# Altium schematic sheet POWER.SchDoc
size A4
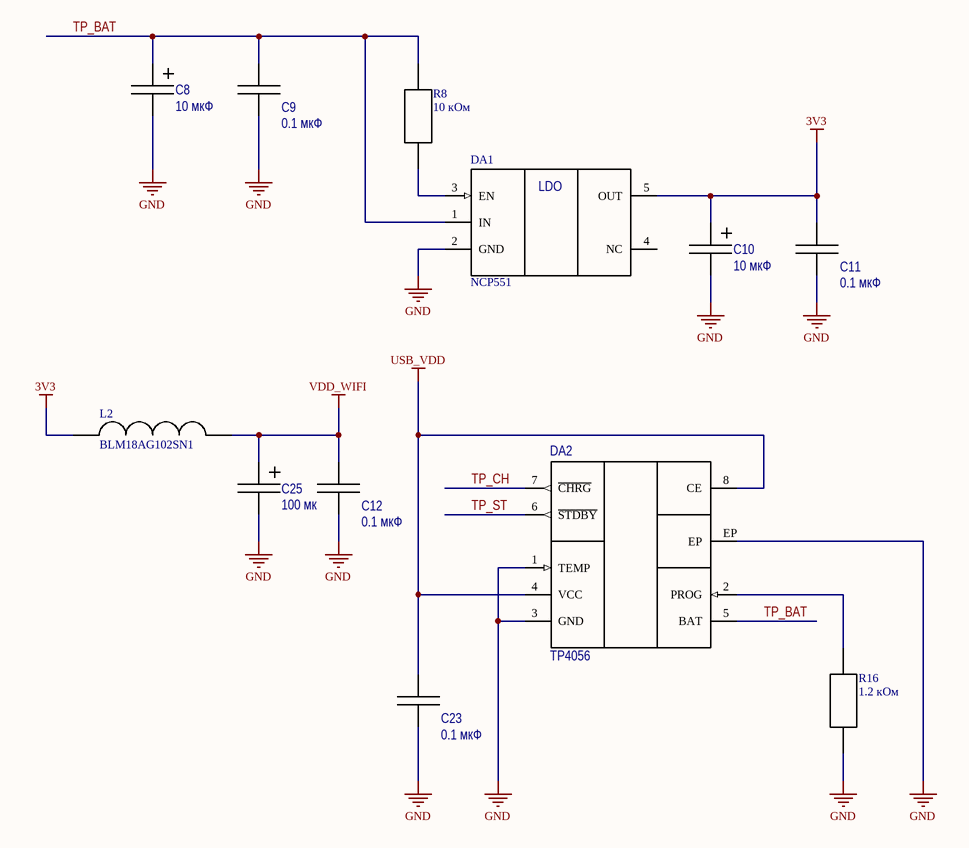
[diagram p0: POWER.SchDoc]

## Parts
C8  10 мкФ  [C TAN_C]
C9  0.1 мкФ  [C 1206]
C10  10 мкФ  [C TAN_C]
C11  0.1 мкФ  [C 1206]
C12  0.1 мкФ  [C 1206]
C23  0.1 мкФ  [C 1206]
C25  value 100 мк  [C TAN_D]
DA1  NCP551  [TSOP-5]
DA2  TP4056  [HSOP-8]
L2  BLM18AG102SN1  [FB 0603]
R8  10 кОм  [RES 0805]
R16  1.2 кОм  [RES 0805]

## Nets
3V3: C10.1 C11.1 DA1.5(OUT) L2.1
GND: C8.2 C9.2 C10.2 C11.2 C12.2 C23.2 C25.2 DA1.2(GND) DA2.1(TEMP) DA2.3(GND) DA2.EP R16.1
USB_VDD: C23.1 DA2.4(VCC) DA2.8(CE)
VDD_WIFI: C12.1 C25.1 L2.2
TP_BAT: C8.1 C9.1 DA1.1(IN) DA2.5(BAT) R8.2
TP_CH: DA2.7(~{CHRG})
TP_ST: DA2.6(~{STDBY})
NetDA1_3: DA1.3(EN) R8.1
NetDA2_2: DA2.2(PROG) R16.2

Not connected (* = marked no-connect by the designer): DA1 4(NC)

## Notes on the sheet
- (in symbol NCP551) LDO

## Library data of the parts
C8 C10 = CAP TAN_C: SMD Tantalium Capacitor C; Manufacturer: /Укажите компанию-производителя/; Tolerance: /Укажите допуск в процентах/; Type: Конденсатор танталовый; ESR: /Укажите значение ЭПС/; Size: C; Temperature range: /Формат: -? ... ? °C/; Value: 10 мкФ
C9 C11 C12 C23 = CAP 1206: SMD Capacitor 1206; Manufacturer: /Укажите компанию-производителя/; Tolerance: /Укажите допуск в процентах/; Temperature coefficient: /Формат: ±? ppm/°C/; Type: Конденсатор керамический; TC: /Укажите тип диэлектрика/; Size: 1206; Temperature range: /Формат: -? ... ? °C/; Value: 0.1 мкФ
C25 = CAP TAN_D: SMD Tantalium Capacitor D; Manufacturer: /Укажите компанию-производителя/; Tolerance: /Укажите допуск в процентах/; Type: Конденсатор танталовый; ESR: /Укажите значение ЭПС/; Rated voltage: 10 В; Size: D; Temperature range: /Формат: -? ... ? °C/
R8 R16 = RES 0805